# Altium schematic sheet MCU.SchDoc
size A4; SheetNumber: 1; SheetTotal: 5
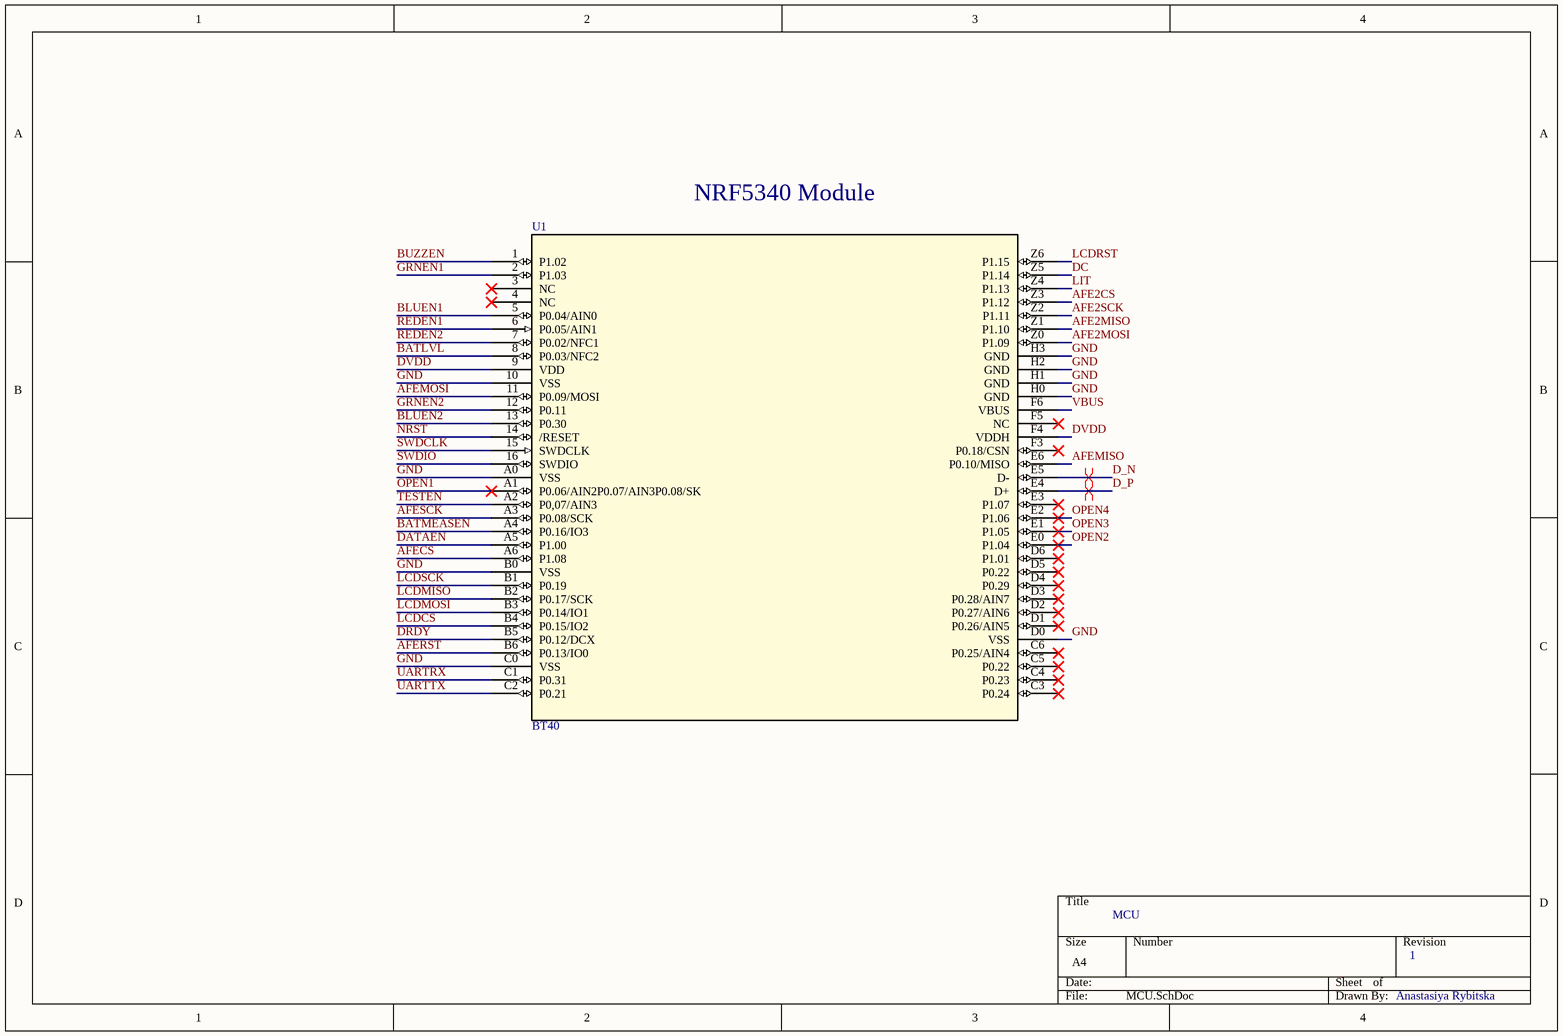
[diagram p0: MCU.SchDoc]

## Parts
U1  BT40  [BT40E_FAN_FNL]

## Nets
AFE2CS: U1.Z3(P1.12)
AFE2MISO: U1.Z1(P1.10)
AFE2MOSI: U1.Z0(P1.09)
AFE2SCK: U1.Z2(P1.11)
AFECS: U1.A6(P1.08)
AFEMISO: U1.E6(P0.10/MISO)
AFEMOSI: U1.11(P0.09/MOSI)
AFERST: U1.B6(P0.13/IO0)
AFESCK: U1.A3(P0.08/SCK)
BATLVL: U1.8(P0.03/NFC2)
BATMEASEN: U1.A4(P0.16/IO3)
BLUEN1: U1.5(P0.04/AIN0)
BLUEN2: U1.13(P0.30)
BUZZEN: U1.1(P1.02)
D_N: U1.E5(D-)
D_P: U1.E4(D+)
DATAEN: U1.A5(P1.00)
DC: U1.Z5(P1.14)
DRDY: U1.B5(P0.12/DCX)
DVDD: U1.9(VDD) U1.F4(VDDH)
GND: U1.10(VSS) U1.A0(VSS) U1.B0(VSS) U1.C0(VSS) U1.D0(VSS) U1.H0(GND) U1.H1(GND) U1.H2(GND) U1.H3(GND)
GRNEN1: U1.2(P1.03)
GRNEN2: U1.12(P0.11)
LCDCS: U1.B4(P0.15/IO2)
LCDMISO: U1.B2(P0.17/SCK)
LCDMOSI: U1.B3(P0.14/IO1)
LCDRST: U1.Z6(P1.15)
LCDSCK: U1.B1(P0.19)
LIT: U1.Z4(P1.13)
NRST: U1.14(/RESET)
OPEN1: U1.A1(P0.06/AIN2P0.07/AIN3P0.08/SK)
OPEN2: U1.E0(P1.04)
OPEN3: U1.E1(P1.05)
OPEN4: U1.E2(P1.06)
REDEN1: U1.6(P0.05/AIN1)
REDEN2: U1.7(P0.02/NFC1)
SWDCLK: U1.15(SWDCLK)
SWDIO: U1.16(SWDIO)
TESTEN: U1.A2(P0,07/AIN3)
UARTRX: U1.C1(P0.31)
UARTTX: U1.C2(P0.21)
VBUS: U1.F6(VBUS)

Not connected (* = marked no-connect by the designer): U1 3(NC)* 4(NC)* C3(P0.24)* C4(P0.23)* C5(P0.22)* C6(P0.25/AIN4)* D1(P0.26/AIN5)* D2(P0.27/AIN6)* D3(P0.28/AIN7)* D4(P0.29)* D5(P0.22)* D6(P1.01)* E3(P1.07)* F3(P0.18/CSN)* F5(NC)*

## Layout directives
differential pair: D_N, D_P

## Notes on the sheet
- NRF5340 Module
- MCU
- 1
- Anastasiya Rybitska

## Library data of the parts
U1 = BT40: No Description Available; Mfr_Name: Fanstel; Type: RF; Copyright: Copyright (C) 2023 Ultra Librarian. All rights reserved.; Manufacturer_Part_Number: BT40; RefDes: RefDes